# EAGLE design ponteH_terza (EAGLE 7.2.0)
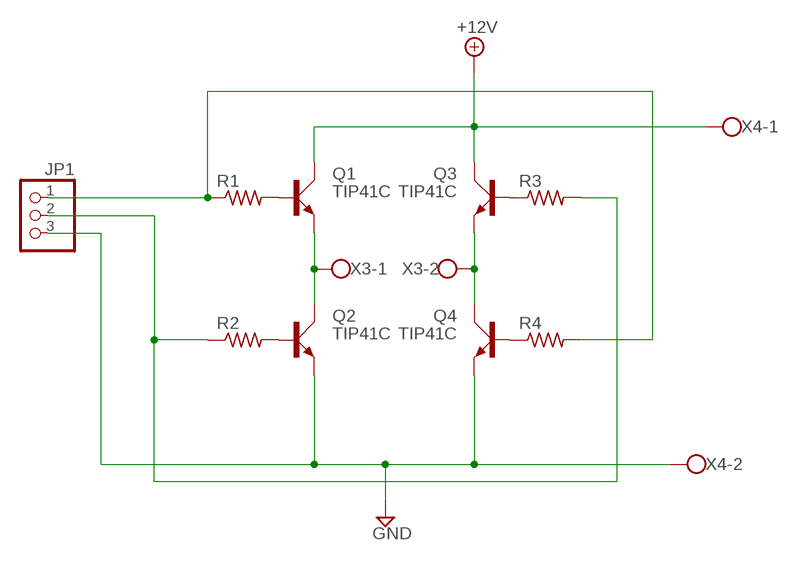
[diagram p0: schematic, sheet 1]

## Parts
JP1  PINHD-1X3  [1X03]
Q1  TIP41C  [TO220AV]
Q2  TIP41C  [TO220AV]
Q3  TIP41C  [TO220AV]
Q4  TIP41C  [TO220AV]
R1  R-US_0207/10  [0207/10]
R2  R-US_0207/10  [0207/10]
R3  R-US_0207/10  [0207/10]
R4  R-US_0207/10  [0207/10]
X3  W237-02P  [W237-132]
X4  W237-02P  [W237-132]

## Nets
+12V: Q1.C Q3.C X4.1
GND: JP1.3 Q2.E Q4.E X4.2
N$1: Q1.B R1.2
N$2: Q2.B R2.2
N$3: Q3.B R3.1
N$4: Q4.B R4.1
N$5: JP1.1 R1.1 R4.2
N$6: JP1.2 R2.1 R3.2
N$10: Q3.E Q4.C X3.2
N$11: Q1.E Q2.C X3.1

## Library data of the parts
JP1 = pinhead:PINHD-1X3: PIN HEADER
Q1-Q4 = transistor-power:TIP41C: NPN TRANSISTOR
R1-R4 = resistor:R-US_: RESISTOR, American symbol
X3 X4 = con-wago-508:W237-02P: WAGO SREW CLAMP

## Board
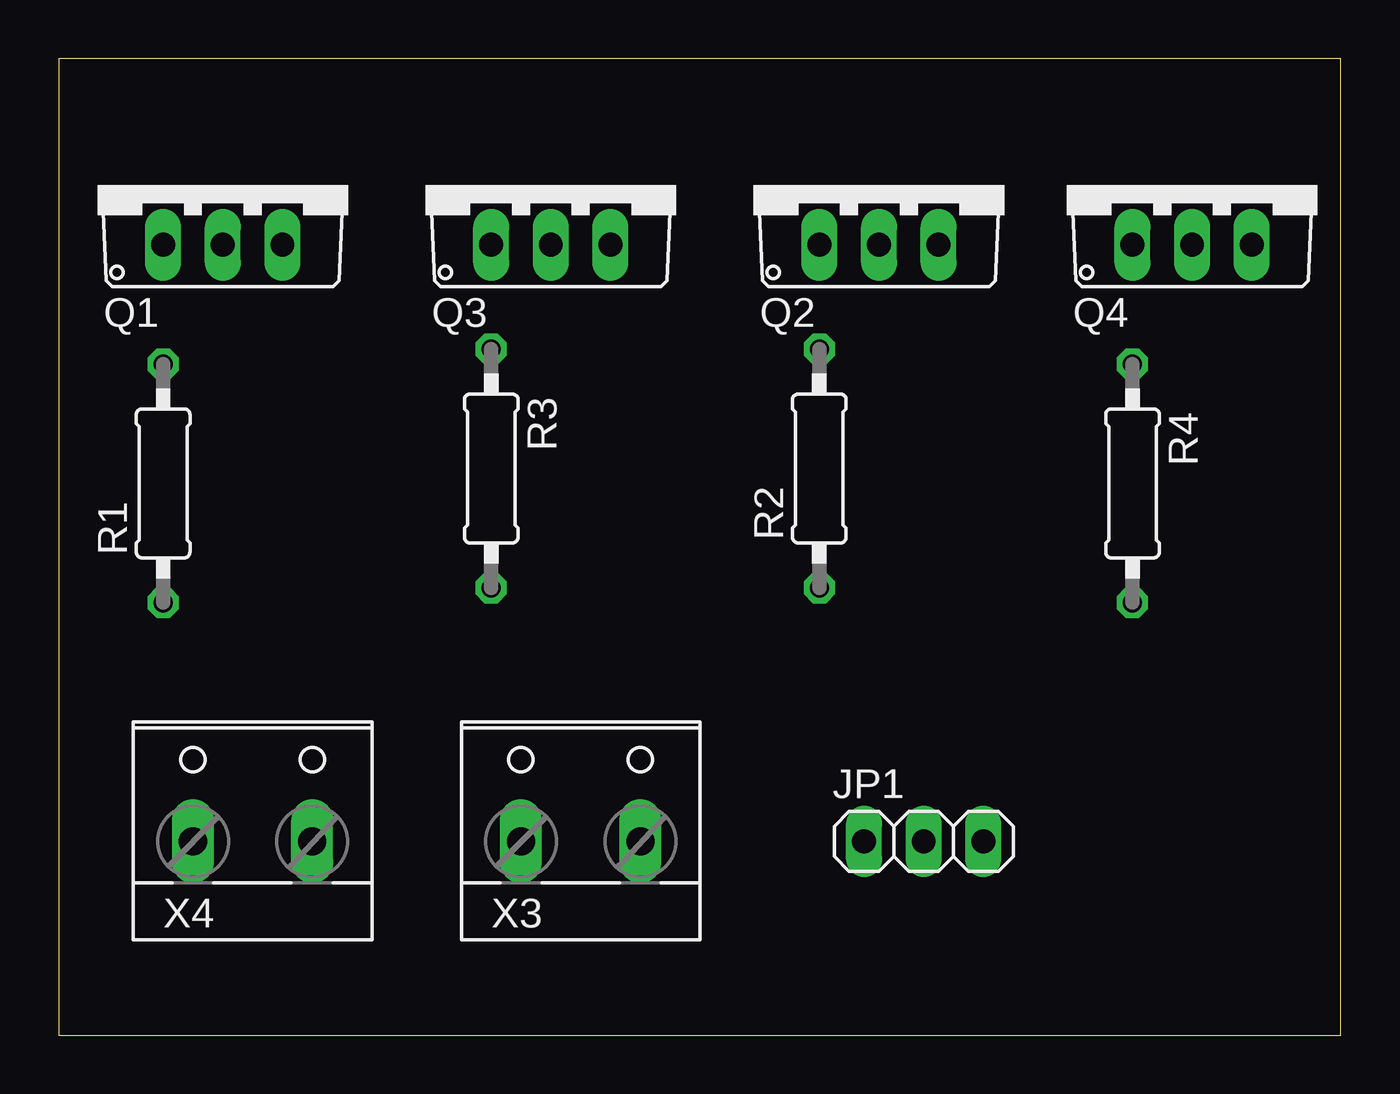
[diagram p1: board, top side]
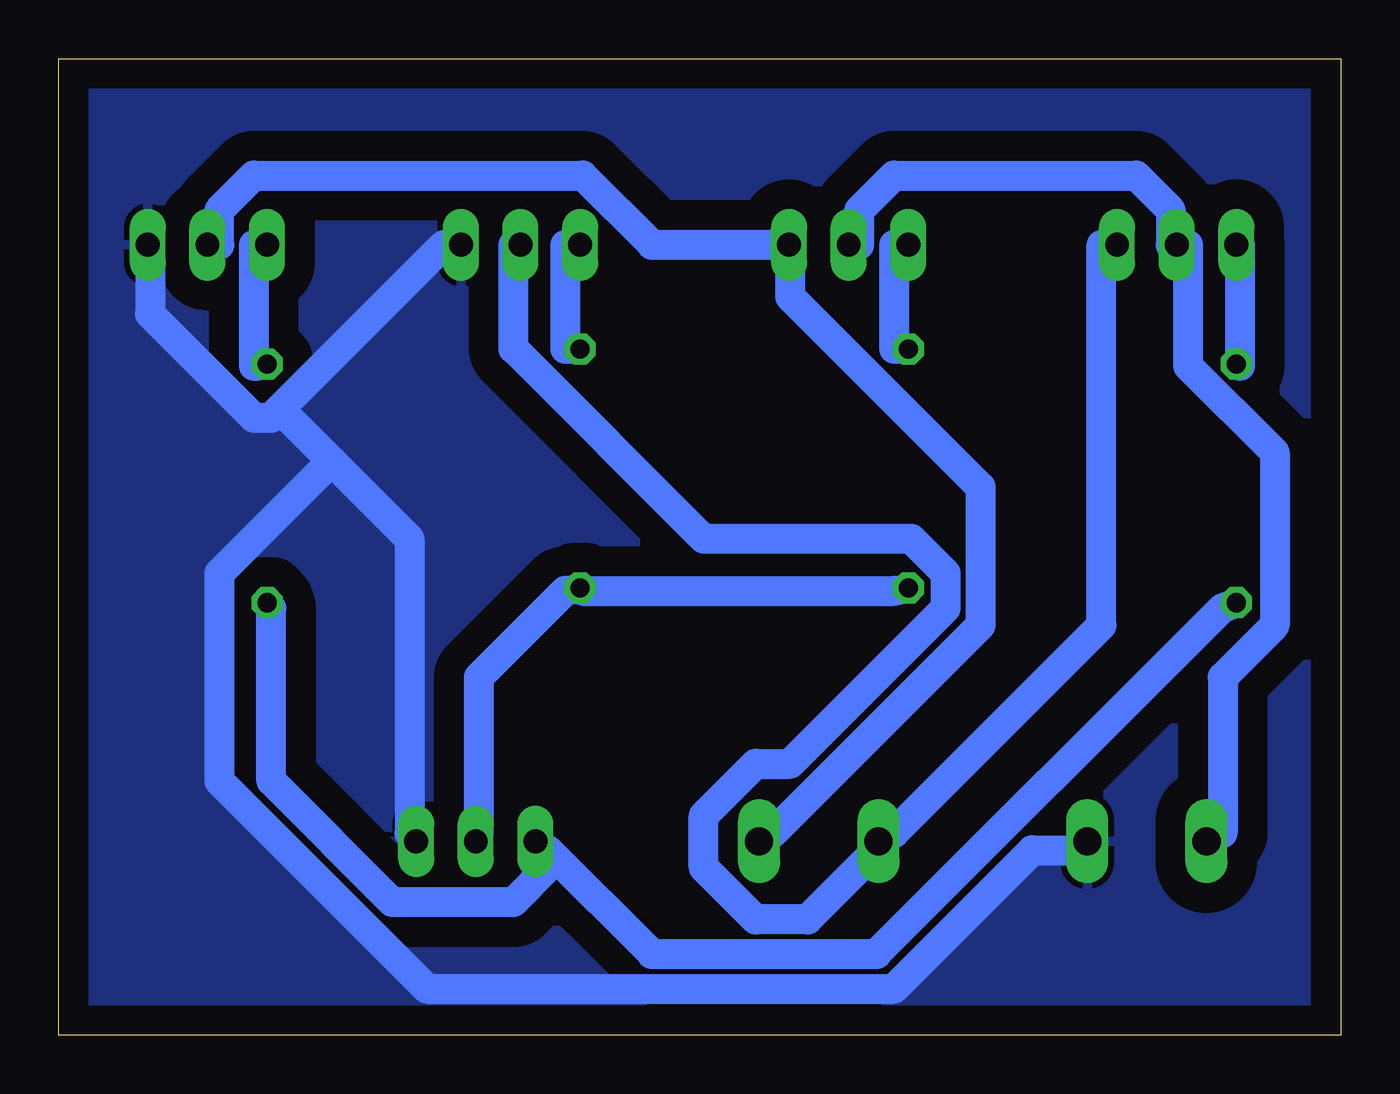
[diagram p2: board, bottom side, seen from below]

Size 54.59 x 41.58 mm. Coordinates in mm from the lower left corner, seen from the top.
Outline: 0,0 54.59,0 54.59,41.58 0,41.58 0,0
Copper layers (1*16): Top 0.035mm / dielectric 1.5mm / Bottom 0.035mm
Design rules "default *": minimum track width 50mil, minimum drill 32mil, track to track 8mil, track to pad 8mil, pad to pad 8mil, via to via 8mil, smd to smd 8mil, copper to edge 40mil, drill to drill 8mil, minimum pad ring 10mil, minimum via ring 8mil, stop-mask expansion 4mil, vias tented up to drill 0mil, thermal gap 10mil

### Footprints (pad centres in the part's own frame; a part is rotated, then mirrored left to right if it is on the bottom)
1X03 = drill 1.016 long: 1 -2.54,0; 2 0,0; 3 2.54,0
TO220AV = drill 1.016 long: B -2.54,-2.54; C 0,-2.54; E 2.54,-2.54
0207/10 = drill 0.813 octagon: 1 -5.08,0; 2 5.08,0
W237-132 = drill 1.194 long: 1 -2.54,-0.635; 2 2.54,-0.635

### Placement (x,y rotation side)
JP1  36.83,8.26 0 top
Q1  6.99,36.2 0 top
Q2  34.92,36.2 0 top
Q3  20.95,36.2 0 top
Q4  48.26,36.2 0 top
R1  4.45,23.5 90 top
R2  32.38,24.13 90 top
R3  18.41,24.13 270 top
R4  45.72,23.5 270 top
X3  22.23,8.89 0 top
X4  8.26,8.89 0 top

### Tracks (layer width: path | path; a pad name or v marks a point on that pad's centre or on a via)
+12V
  Bottom 1.27: Q3.C 20.5,33.66 20.5,35.13 19.02,36.6 8.71,36.6 7.24,35.13 7.24,33.66 Q1.C 6.5,33.66 6.5,28.5 2.82,24.82 2.82,17.45 5.03,15.24 5.03,8.61 X4.1
GND
  Bottom 1.27: 45.17,26.66 45.54,26.29 46.28,26.29 50.7,30.71 50.7,33.66 Q4.E | 45.17,26.66 38.18,33.66 Q2.E | 45.17,26.66 42.96,24.45 | 42.96,24.45 39.65,21.13 39.65,8.61 JP1.3 | 42.96,24.45 47.75,19.66 47.75,10.82 38.91,1.98 19.02,1.98 13.13,7.87 10.92,7.87 X4.2
  pour Bottom (isolate 1.27): 0,41.27 0,0 54.61,0 54.61,41.27
N$1
  Bottom 1.27: R1.2 4.29,28.5 4.29,33.66 Q1.B
N$2
  Bottom 1.27: R2.2 33.02,29.23 33.02,33.66 Q2.B
N$3
  Bottom 1.27: R3.1 19.02,29.23 19.02,33.66 Q3.B
N$4
  Bottom 1.27: R4.1 46.28,28.5 46.28,33.66 Q4.B
N$5
  Bottom 1.27: R1.1 5.03,18.19 19.76,3.45 29.34,3.45 33.76,7.87 JP1.1 33.76,7.14 35.23,5.66 40.39,5.66 45.54,10.82 45.54,18.19 R4.2
N$6
  Bottom 1.27: R3.2 19.02,18.92 32.28,18.92 R2.1 33.02,18.92 36.7,15.24 36.7,8.61 JP1.2
N$10
  Bottom 1.27: Q4.C 47.75,33.66 47.75,35.13 46.28,36.6 32.28,36.6 29.34,33.66 Q3.E 23.44,33.66 23.44,31.45 15.34,23.34 15.34,17.45 24.18,8.61 X3.2
N$11
  Bottom 1.27: Q1.E 10.19,33.66 10.19,17.45 19.02,8.61 X3.1 19.76,7.87 22.71,4.93 24.92,4.93 27.13,7.14 27.13,9.35 24.92,11.56 23.44,11.56 16.82,18.19 16.82,19.66 18.29,21.13 27.13,21.13 35.23,29.23 35.23,33.66 Q2.C